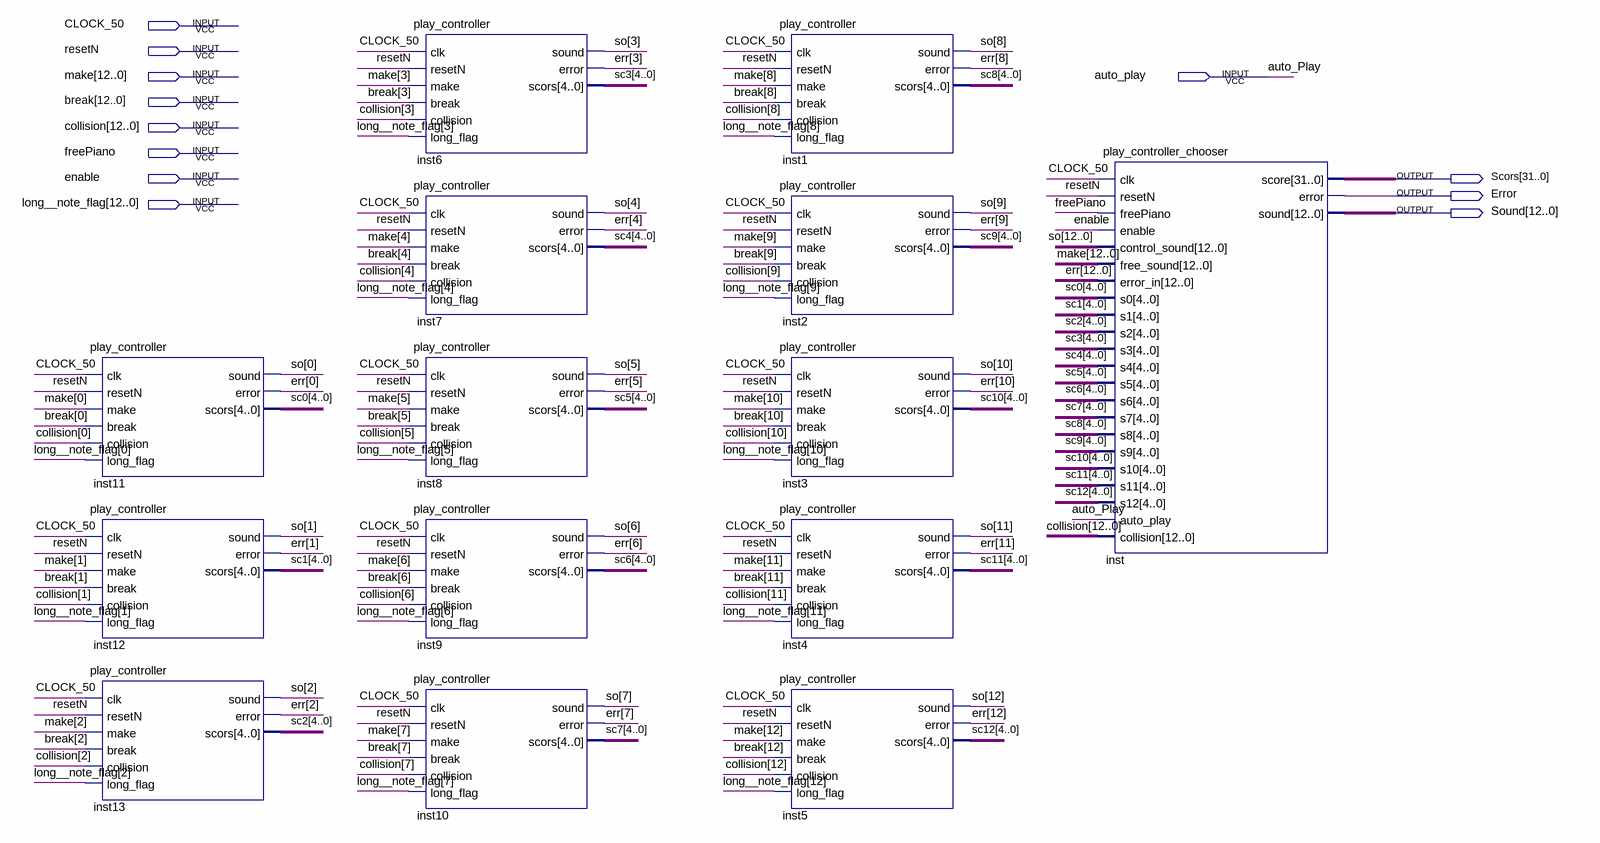
[diagram p0: schematic sheet]
// Quartus schematic top_play_controller.bdf as structural Verilog: 14 symbols, 12 pins
module top_play_controller (
  input  CLOCK_50,
  input  resetN,
  input  [12:0] make,
  input  auto_play,
  input  [12:0] \break ,
  input  [12:0] collision,
  input  freePiano,
  input  enable,
  input  [12:0] long__note_flag,
  output [31:0] Scors,
  output Error,
  output [12:0] Sound
);

  wire [4:0] sc0, sc1, sc2, sc3, sc4, sc5, sc6, sc7, sc8, sc9, sc10, sc11, sc12;
  wire [12:0] err, so;

  play_controller inst11 (
    .clk(CLOCK_50), .resetN(resetN), .make(make[0]), .\break (\break [0]), .collision(collision[0]),
    .long_flag(long__note_flag[0]), .sound(so[0]), .error(err[0]), .scors(sc0));
  play_controller inst12 (
    .clk(CLOCK_50), .resetN(resetN), .make(make[1]), .\break (\break [1]), .collision(collision[1]),
    .long_flag(long__note_flag[1]), .sound(so[1]), .error(err[1]), .scors(sc1));
  play_controller inst13 (
    .clk(CLOCK_50), .resetN(resetN), .make(make[2]), .\break (\break [2]), .collision(collision[2]),
    .long_flag(long__note_flag[2]), .sound(so[2]), .error(err[2]), .scors(sc2));
  play_controller inst6 (
    .clk(CLOCK_50), .resetN(resetN), .make(make[3]), .\break (\break [3]), .collision(collision[3]),
    .long_flag(long__note_flag[3]), .sound(so[3]), .error(err[3]), .scors(sc3));
  play_controller inst7 (
    .clk(CLOCK_50), .resetN(resetN), .make(make[4]), .\break (\break [4]), .collision(collision[4]),
    .long_flag(long__note_flag[4]), .sound(so[4]), .error(err[4]), .scors(sc4));
  play_controller inst8 (
    .clk(CLOCK_50), .resetN(resetN), .make(make[5]), .\break (\break [5]), .collision(collision[5]),
    .long_flag(long__note_flag[5]), .sound(so[5]), .error(err[5]), .scors(sc5));
  play_controller inst9 (
    .clk(CLOCK_50), .resetN(resetN), .make(make[6]), .\break (\break [6]), .collision(collision[6]),
    .long_flag(long__note_flag[6]), .sound(so[6]), .error(err[6]), .scors(sc6));
  play_controller inst10 (
    .clk(CLOCK_50), .resetN(resetN), .make(make[7]), .\break (\break [7]), .collision(collision[7]),
    .long_flag(long__note_flag[7]), .sound(so[7]), .error(err[7]), .scors(sc7));
  play_controller inst1 (
    .clk(CLOCK_50), .resetN(resetN), .make(make[8]), .\break (\break [8]), .collision(collision[8]),
    .long_flag(long__note_flag[8]), .sound(so[8]), .error(err[8]), .scors(sc8));
  play_controller inst2 (
    .clk(CLOCK_50), .resetN(resetN), .make(make[9]), .\break (\break [9]), .collision(collision[9]),
    .long_flag(long__note_flag[9]), .sound(so[9]), .error(err[9]), .scors(sc9));
  play_controller inst3 (
    .clk(CLOCK_50), .resetN(resetN), .make(make[10]), .\break (\break [10]), .collision(collision[10]),
    .long_flag(long__note_flag[10]), .sound(so[10]), .error(err[10]), .scors(sc10));
  play_controller inst4 (
    .clk(CLOCK_50), .resetN(resetN), .make(make[11]), .\break (\break [11]), .collision(collision[11]),
    .long_flag(long__note_flag[11]), .sound(so[11]), .error(err[11]), .scors(sc11));
  play_controller inst5 (
    .clk(CLOCK_50), .resetN(resetN), .make(make[12]), .\break (\break [12]), .collision(collision[12]),
    .long_flag(long__note_flag[12]), .sound(so[12]), .error(err[12]), .scors(sc12));
  play_controller_chooser inst (
    .clk(CLOCK_50), .resetN(resetN), .freePiano(freePiano), .enable(enable), .control_sound(so),
    .free_sound(make), .error_in(err), .s0(sc0), .s1(sc1), .s2(sc2), .s3(sc3), .s4(sc4), .s5(sc5), .s6(sc6),
    .s7(sc7), .s8(sc8), .s9(sc9), .s10(sc10), .s11(sc11), .s12(sc12), .auto_play(auto_play),
    .collision(collision), .score(Scors), .error(Error), .sound(Sound));
endmodule
